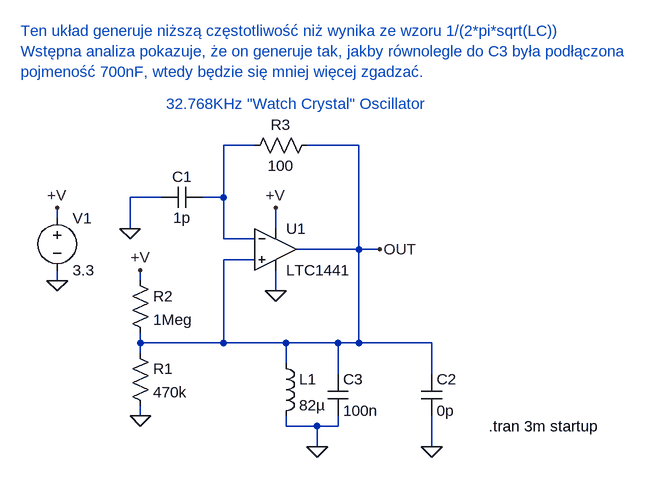
[diagram p0: schematic LTC1441_example.asc]
LTC1441_example.asc, the LTspice schematic file:
Version 4
SHEET 1 1076 800
WIRE 304 112 256 112
WIRE 464 112 384 112
WIRE 160 192 112 192
WIRE 256 192 256 112
WIRE 256 192 224 192
WIRE 0 224 0 208
WIRE 112 240 112 192
WIRE 336 240 336 208
WIRE 256 256 256 192
WIRE 304 256 256 256
WIRE 464 272 464 112
WIRE 464 272 368 272
WIRE 496 272 464 272
WIRE 304 288 256 288
WIRE 0 320 0 304
WIRE 128 320 128 304
WIRE 336 336 336 304
WIRE 128 416 128 400
WIRE 256 416 256 288
WIRE 256 416 128 416
WIRE 352 416 256 416
WIRE 432 416 352 416
WIRE 464 416 464 272
WIRE 464 416 432 416
WIRE 576 416 464 416
WIRE 128 432 128 416
WIRE 352 448 352 416
WIRE 432 464 432 416
WIRE 576 464 576 416
WIRE 128 528 128 512
WIRE 352 544 352 528
WIRE 400 544 352 544
WIRE 432 544 432 528
WIRE 432 544 400 544
WIRE 400 576 400 544
WIRE 576 576 576 528
FLAG 0 320 0
FLAG 0 208 +V
FLAG 336 208 +V
FLAG 336 336 0
FLAG 128 528 0
FLAG 128 304 +V
FLAG 112 240 0
FLAG 496 272 OUT
FLAG 400 576 0
FLAG 576 576 0
SYMBOL voltage 0 208 R0
WINDOW 123 0 0 Left 0
WINDOW 39 0 0 Left 0
SYMATTR InstName V1
SYMATTR Value 3.3
SYMBOL Comparators\\LTC1441 336 208 R0
SYMATTR InstName U1
SYMBOL res 112 416 R0
SYMATTR InstName R1
SYMATTR Value 470k
SYMBOL res 112 304 R0
SYMATTR InstName R2
SYMATTR Value 1Meg
SYMBOL res 400 96 R90
WINDOW 0 0 56 VBottom 2
WINDOW 3 32 56 VTop 2
SYMATTR InstName R3
SYMATTR Value 100
SYMBOL ind 336 432 R0
SYMATTR InstName L1
SYMATTR Value 82µ
SYMBOL cap 416 464 R0
SYMATTR InstName C3
SYMATTR Value 100n
SYMBOL cap 224 176 R90
WINDOW 0 0 32 VBottom 2
WINDOW 3 32 32 VTop 2
SYMATTR InstName C1
SYMATTR Value 1p
SYMBOL cap 560 464 R0
SYMATTR InstName C2
SYMATTR Value 0p
TEXT 664 544 Left 2 !.tran 3m startup
TEXT 368 64 Bottom 2 ;32.768KHz "Watch Crystal" Oscillator
TEXT -56 -64 Left 2 ;Ten układ generuje niższą częstotliwość niż wynika ze wzoru 1/(2*pi*sqrt(LC))\nWstępna analiza pokazuje, że on generuje tak, jakby równolegle do C3 była podłączona\npojmeność 700nF, wtedy będzie się mniej więcej zgadzać.

The netlist it stands for:
* LTC1441_example.asc
V1 +V 0 3.3
XU1 OUT N001 +V 0 OUT LTC1441  ; pins In+ In- V+ V- OUT
R1 OUT 0 470k
R2 +V OUT 1Meg
R3 OUT N001 100
L1 OUT 0 82µ
C3 OUT 0 100n
C1 N001 0 1p
C2 OUT 0 0p
.tran 3m startup
* 32.768KHz "Watch Crystal" Oscillator
* Ten układ generuje niższą częstotliwość niż wynika ze wzoru 1/(2*pi*sqrt(LC))
* Wstępna analiza pokazuje, że on generuje tak, jakby równolegle do C3 była podłączona
* pojmeność 700nF, wtedy będzie się mniej więcej zgadzać.
.backanno
.end